# EAGLE schematic HV Board rev14 (EAGLE 9.6.2)
ENGINEER: Arvind Srinivasan

## Sheet 1 of 3: GLV Systems 1 (Main I/O, Power, Current Sensors, and Shutdown Circuit)
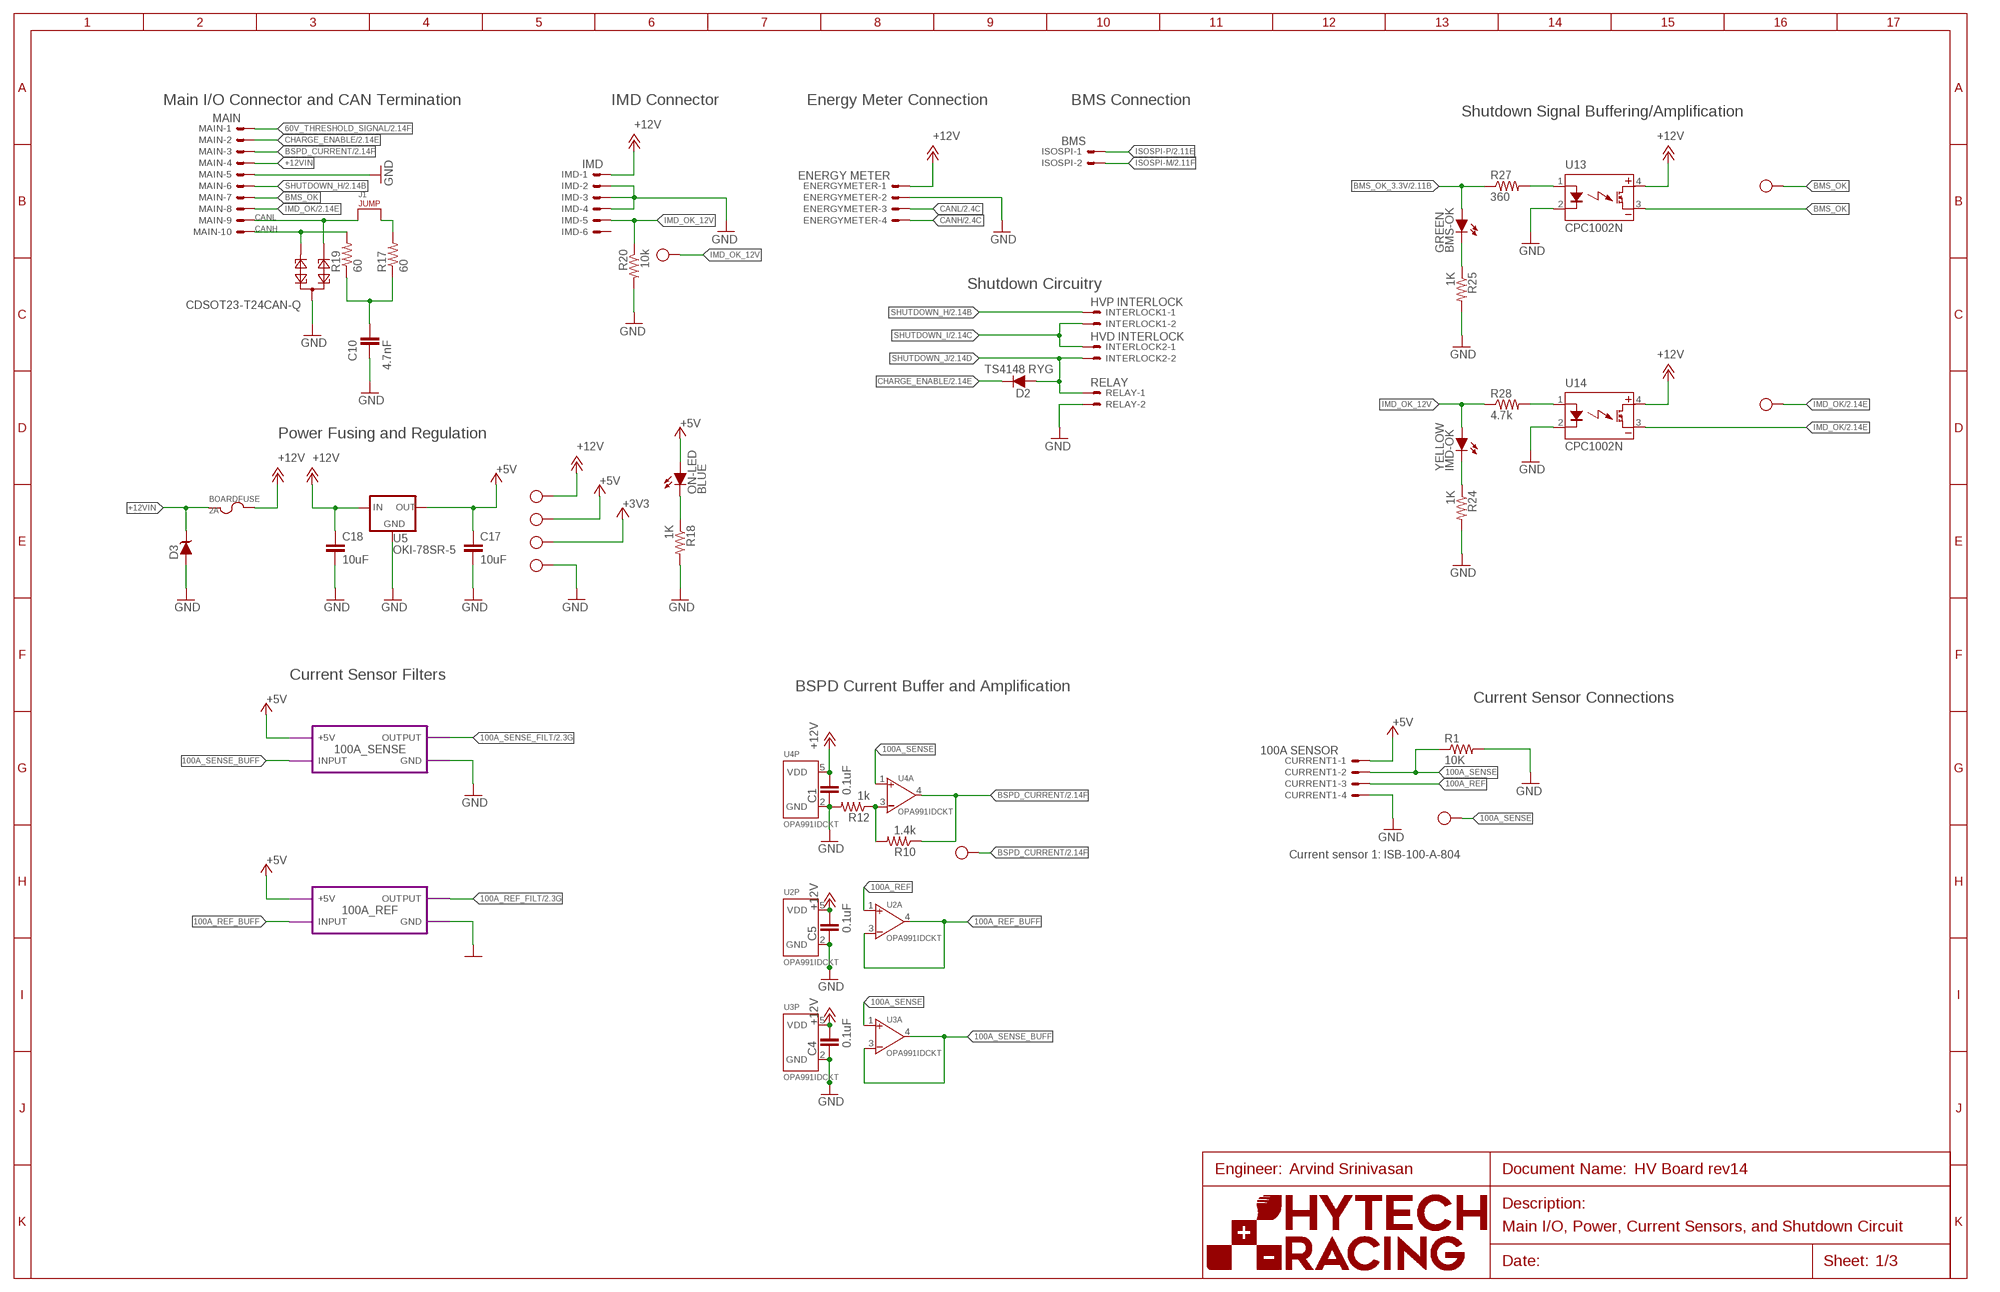
[diagram p0: schematic, sheet 1]
U$1 (FRAME_B): FRAME_DESCRIPTION: Main I/O, Power, Current Sensors, and Shutdown Circuit; ORIENTATION: LANDSCAPE; SIZE: B

### Parts
$$U$3  TEST_POINTMICRO_MINIATURE  [MICRO_MINIATURE]
$$U$12  TEST_POINTMICRO_MINIATURE  [MICRO_MINIATURE]
BMS-OK  GREEN  LED-0603  [LED-603]
BOARDFUSE  2A  FUSE_MINIBLADE  [MINI-BLADE_FUSE_HOLDER]
C1  0.1uF  CAP0603-CAP  [0603-CAP@1]
C4  0.1uF  CAP0603-CAP  [0603-CAP@1]
C5  0.1uF  CAP0603-CAP  [0603-CAP@1]
C10  4.7nF  CAP0603-CAP  [0603-CAP@1]
C17  10uF  CAP0603-CAP  [0603-CAP@1]
C18  10uF  CAP0603-CAP  [0603-CAP@1]
CURRENT1  100A SENSOR  CONNECTOR-4NANO-FIT-VERTICAL-4  [NANO-FIT_VERTICAL-4]
D2  TS4148 RYG  DIODE0805  [0805_D]
D3  TVS_15V  [SOT-23]
ENERGYMETER  ENERGY METER  CONNECTOR-4NANO-FIT-VERTICAL-4  [NANO-FIT_VERTICAL-4]
IMD  IMD  CONNECTOR-6NANO-FIT_VERTICAL-6  [NANO-FIT_VERTICAL-6]
IMD-OK  YELLOW  LED-0603  [LED-603]
INTERLOCK1  HVP INTERLOCK  CONNECTOR-2NANO-FIT_VERTICAL-2  [NANO-FIT_VERTICAL-2]
INTERLOCK2  HVD INTERLOCK  CONNECTOR-2NANO-FIT_VERTICAL-2  [NANO-FIT_VERTICAL-2]
ISOSPI  BMS  CONNECTOR-2NANO-FIT_VERTICAL-2  [NANO-FIT_VERTICAL-2]
J1  JUMPER.1  [1X02]
MAIN  MAIN  CONNECTOR-10NANO-FIT_VERTICAL-10  [NANO-FIT_VERTICAL-10]
ON-LED  BLUE  LED-0603  [LED-603]
R1  10K  RESISTOR0603  [0603-RES@1]
R10  1.4k  RESISTOR0603  [0603-RES@1]
R12  1k  RESISTOR0603  [0603-RES@1]
R17  60  RESISTOR0603  [0603-RES@1]
R18  1K  RESISTOR0603  [0603-RES@1]
R19  60  RESISTOR0603  [0603-RES@1]
R20  10k  RESISTOR0603  [0603-RES@1]
R24  1K  RESISTOR0603  [0603-RES@1]
R25  1K  RESISTOR0603  [0603-RES@1]
R27  360  RESISTOR0603  [0603-RES@1]
R28  4.7k  RESISTOR0603  [0603-RES@1]
RELAY  RELAY  CONNECTOR-2NANO-FIT_VERTICAL-2  [NANO-FIT_VERTICAL-2]
U2  OPAMP_1_CHANNEL_OPA991  [SC-70-5]
U3  OPAMP_1_CHANNEL_OPA991  [SC-70-5]
U4  OPAMP_1_CHANNEL_OPA991  [SC-70-5]
U5  OKI-78SR-5  [OKI-78SR@1]
U10  CDSOT23-T24CAN-Q  [SOT23]
U13  CPC1002N  [SOP04]
U14  CPC1002N  [SOP04]
U$3  TEST_POINTMICRO_MINIATURE  [MICRO_MINIATURE]
U$4  TEST_POINTMICRO_MINIATURE  [MICRO_MINIATURE]
U$5  TEST_POINTMICRO_MINIATURE  [MICRO_MINIATURE]
U$6  TEST_POINTMICRO_MINIATURE  [MICRO_MINIATURE]
U$7  TEST_POINTMICRO_MINIATURE  [MICRO_MINIATURE]
U$11  TEST_POINTMICRO_MINIATURE  [MICRO_MINIATURE]
U$13  TEST_POINTMICRO_MINIATURE  [MICRO_MINIATURE]

### Module instances
100A_SENSE = 1KHZ-FILTER
100A_REF = 1KHZ-FILTER

### Nets
60V_THRESHOLD_SIGNAL: MAIN.P$1 ; also sheet 2,3
100A_REF: CURRENT1.P$3 U2.1(A:VIN+)
100A_REF_BUFF: U2.3(A:VIN-) U2.4(A:VOUT) ; port 100A_REF.INPUT
100A_REF_FILT: port 100A_REF.OUTPUT ; also sheet 2
100A_SENSE: CURRENT1.P$2 R1.1 U3.1(A:VIN+) U4.1(A:VIN+) U$4.P$1
100A_SENSE_BUFF: U3.3(A:VIN-) U3.4(A:VOUT) ; port 100A_SENSE.INPUT
100A_SENSE_FILT: port 100A_SENSE.OUTPUT ; also sheet 2
+3V3: U$7.P$1 ; also sheet 2
+5V: $$U$3.P$1 C17.1 CURRENT1.P$1 ON-LED.A U5.3(OUT) ; port 100A_SENSE.+5V 100A_REF.+5V ; also sheet 2
+12V: BOARDFUSE.R1 BOARDFUSE.R2 C1.2 C4.2 C5.2 C18.1 ENERGYMETER.P$1 IMD.P$1 U2.5(P:VDD) U3.5(P:VDD) U4.5(P:VDD) U5.1(IN) U13.4(DC+) U14.4(DC+) U$5.P$1 ; also sheet 2,3
+12VIN: BOARDFUSE.L1 BOARDFUSE.L2 D3.3(C) MAIN.P$4
BMS_OK: MAIN.P$7 U13.3(DC-) U$13.P$1
BMS_OK_3.3V: BMS-OK.A R27.1 ; also sheet 2
BSPD_CURRENT: MAIN.P$3 R10.1 U4.4(A:VOUT) U$6.P$1 ; also sheet 2
CANH: ENERGYMETER.P$4 MAIN.P$10 R19.2 U10.2 ; also sheet 2
CANL: ENERGYMETER.P$3 J1.1 MAIN.P$9 U10.1 ; also sheet 2
CHARGE_ENABLE: D2.C MAIN.P$2 ; also sheet 2
GND: C1.1 C4.1 C5.1 C10.1 C17.2 C18.2 CURRENT1.P$4 D3.1(A) ENERGYMETER.P$2 IMD.P$2 IMD.P$3 IMD.P$4 MAIN.P$5 R1.2 R12.2 R18.2 R20.2 R24.2 R25.2 RELAY.P$2 U2.2(P:GND) U3.2(P:GND) U4.2(P:GND) U5.2(GND) U10.3 U13.2(CONTROL-) U14.2(CONTROL-) U$3.P$1 ; port 100A_SENSE.GND 100A_REF.GND ; also sheet 2,3
IMD_OK: $$U$12.P$1 MAIN.P$8 U14.3(DC-) ; also sheet 2
IMD_OK_12V: IMD-OK.A IMD.P$5 R20.1 R28.1 U$11.P$1
ISOSPI-M [ISO_SPI]: ISOSPI.P$2 ; also sheet 2
ISOSPI-P [ISO_SPI]: ISOSPI.P$1 ; also sheet 2
N$3: ON-LED.C R18.1
N$8: R28.2 U14.1(CONTROL+)
N$9: IMD-OK.C R24.1
N$11: C10.2 R17.1 R19.1
N$15: R10.2 R12.1 U4.3(A:VIN-)
N$16: R27.2 U13.1(CONTROL+)
N$17: BMS-OK.C R25.1
N$23: J1.2 R17.2
SHUTDOWN_H: INTERLOCK1.P$1 MAIN.P$6 ; also sheet 2
SHUTDOWN_I: INTERLOCK1.P$2 INTERLOCK2.P$1 ; also sheet 2
SHUTDOWN_J: D2.A INTERLOCK2.P$2 RELAY.P$1 ; also sheet 2,3
Unconnected: IMD.P$6

### Notes on the sheet
- Main I/O Connector and CAN Termination | IMD Connector | Energy Meter Connection | BMS Connection
- Shutdown Signal Buffering/Amplification
- Shutdown Circuitry
- Power Fusing and Regulation
- Current Sensor Filters
- BSPD Current Buffer and Amplification
- Current Sensor Connections
- Current sensor 1: ISB-100-A-804

## Sheet 2 of 3: GLV Systems 2 (Microcontroller, Watchdog, BMS, CAN, and ADC)
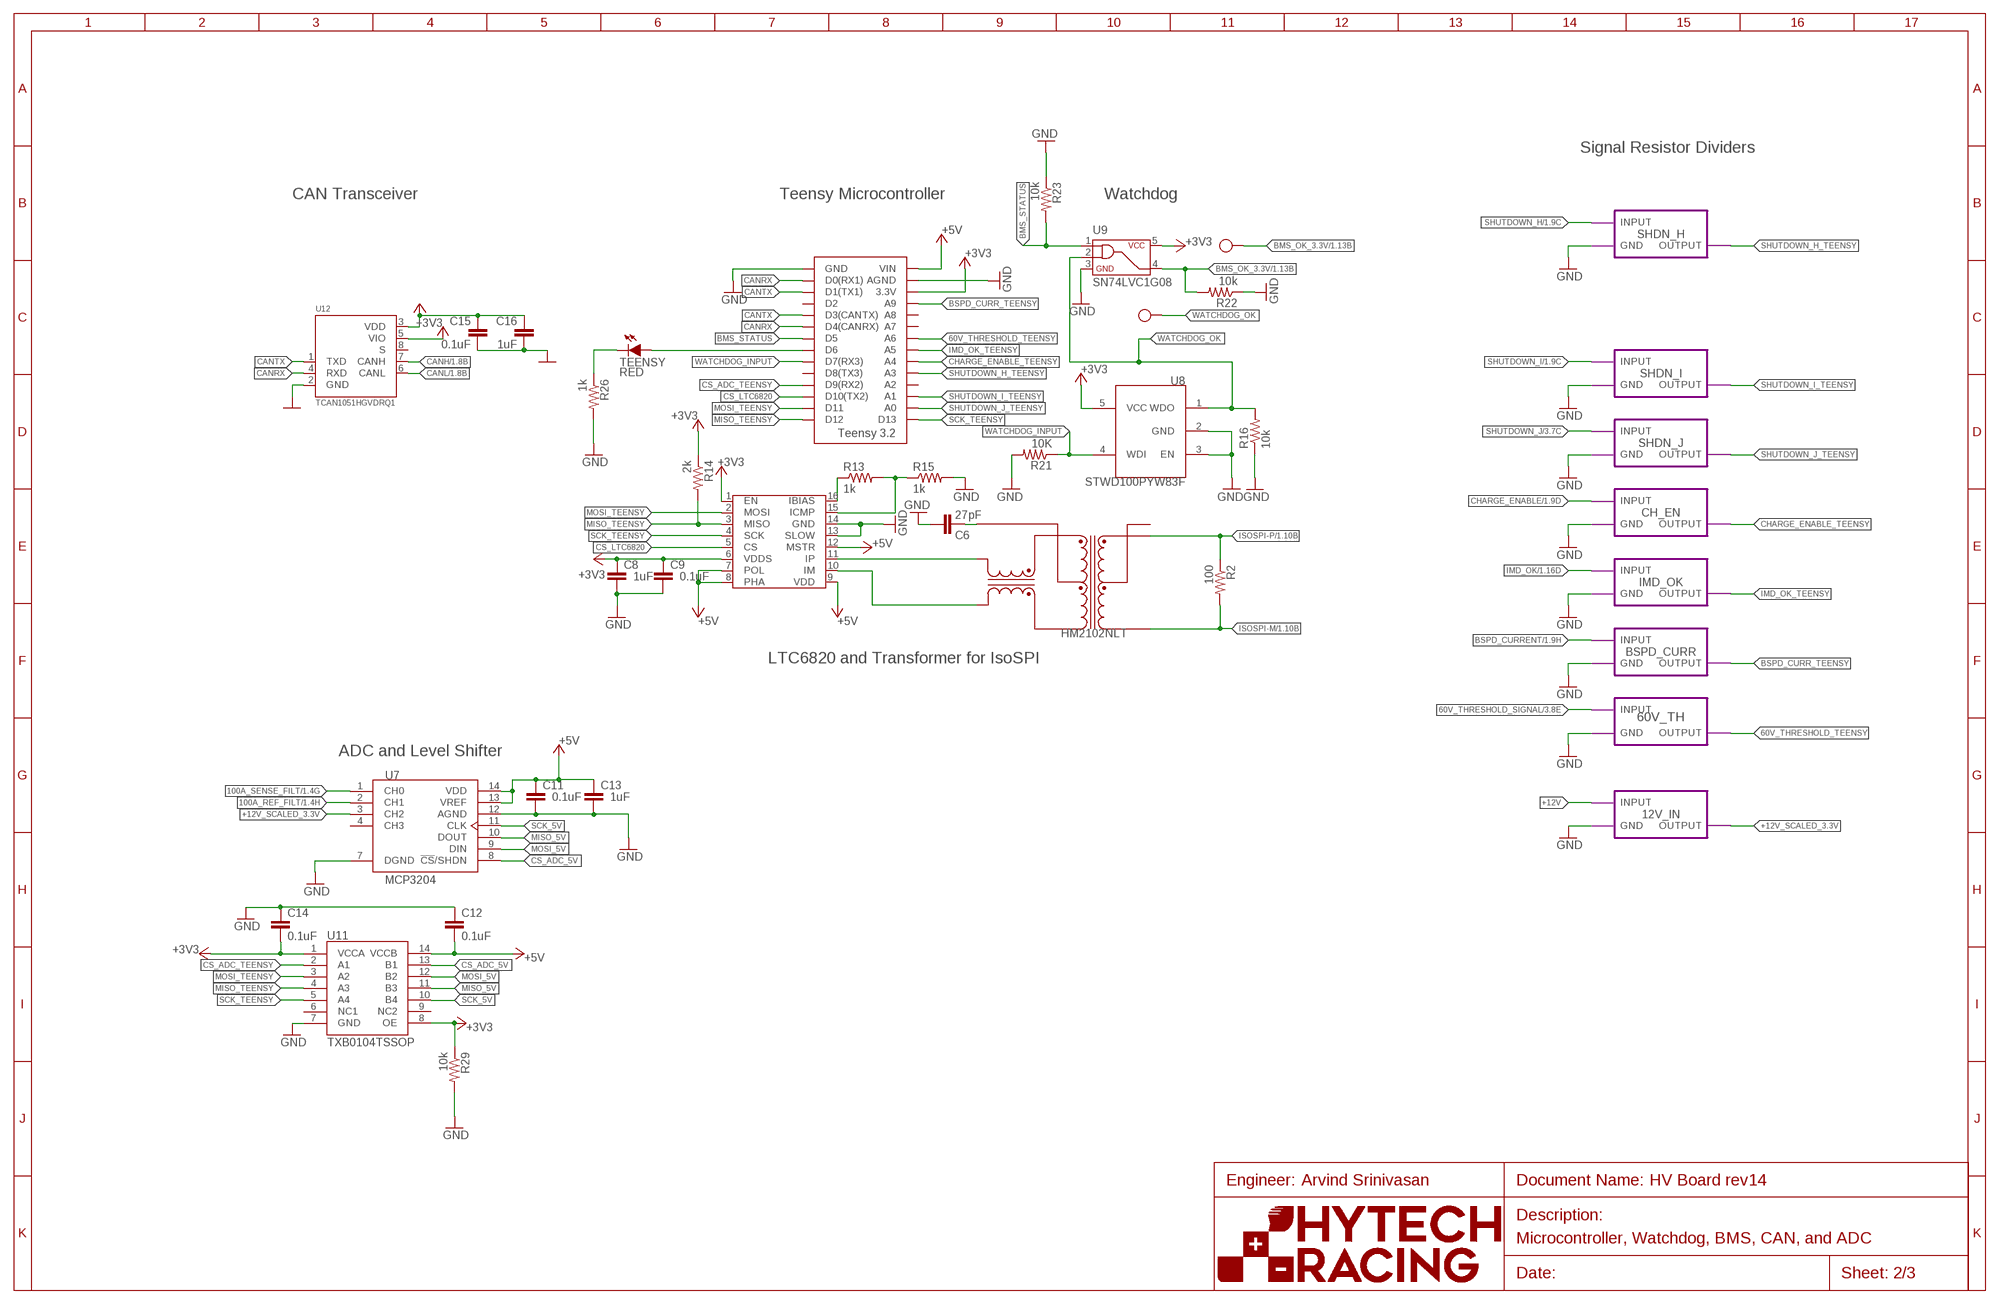
[diagram p1: schematic, sheet 2]
U$12 (FRAME_B): FRAME_DESCRIPTION: Microcontroller, Watchdog, BMS, CAN, and ADC; ORIENTATION: LANDSCAPE; SIZE: B

### Parts
C6  27pF  CAP0603-CAP  [0603-CAP@1]
C8  1uF  CAP0603-CAP  [0603-CAP@1]
C9  0.1uF  CAP0603-CAP  [0603-CAP@1]
C11  0.1uF  CAP0603-CAP  [0603-CAP@1]
C12  0.1uF  CAP0603-CAP  [0603-CAP@1]
C13  1uF  CAP0603-CAP  [0603-CAP@1]
C14  0.1uF  CAP0603-CAP  [0603-CAP@1]
C15  0.1uF  CAP0603-CAP  [0603-CAP@1]
C16  1uF  CAP0603-CAP  [0603-CAP@1]
R2  100  RESISTOR0603  [0603-RES@1]
R13  1k  RESISTOR0603  [0603-RES@1]
R14  2k  RESISTOR0603  [0603-RES@1]
R15  1k  RESISTOR0603  [0603-RES@1]
R16  10k  RESISTOR0603  [0603-RES@1]
R21  10K  RESISTOR0603  [0603-RES@1]
R22  10k  RESISTOR0603  [0603-RES@1]
R23  10k  RESISTOR0603  [0603-RES@1]
R26  1k  RESISTOR0603  [0603-RES@1]
R29  10k  RESISTOR0603  [0603-RES@1]
TEENSY  RED  LED-0603  [LED-603]
TEENSY3.1  TEENSY_3.2_SIMPLE  [TEENSY_3.2_SIMPLE]
U1  HM2102NLT  [HM2102NLT]
U6  LTC6820  [MSOP-16]
U7  MCP3204  [SO14]
U8  STWD100PYW83F  [SOT323-5]
U9  SN74LVC1G08  SN74LVC1G08SOT-323-5  [SOT323-5]
U11  TXB0104TSSOP  [TSSOP-14]
U12  CAN_TRANSCIEVER_TCAN1051HQV-Q1  [SOIC-08]
U$9  TEST_POINTMICRO_MINIATURE  [MICRO_MINIATURE]
U$10  TEST_POINTMICRO_MINIATURE  [MICRO_MINIATURE]

### Module instances
SHDN_J = 43/12-RESISTOR-DIVIDER
SHDN_H = 43/12-RESISTOR-DIVIDER
IMD_OK = 43/12-RESISTOR-DIVIDER
BSPD_CURR = 43/12-RESISTOR-DIVIDER
CH_EN = 43/12-RESISTOR-DIVIDER
SHDN_I = 43/12-RESISTOR-DIVIDER
12V_IN = 43/12-RESISTOR-DIVIDER
60V_TH = 43/12-RESISTOR-DIVIDER

### Nets
60V_THRESHOLD_SIGNAL: port 60V_TH.INPUT ; also sheet 1,3
60V_THRESHOLD_TEENSY: TEENSY3.1.A6 ; port 60V_TH.OUTPUT
100A_REF_FILT: U7.2(CH1) ; also sheet 1
100A_SENSE_FILT: U7.1(CH0) ; also sheet 1
+3V3: C8.1 C9.1 C14.1 R14.1 R29.1 TEENSY3.1.3.3V U6.1(EN) U6.6(VDDS) U8.5(VCC) U9.5 U11.1(VCCA) U11.8(OE) U12.5(VIO) ; also sheet 1
+5V: C11.1 C12.1 C13.1 C15.2 C16.2 TEENSY3.1.VIN U6.7(POL) U6.8(PHA) U6.9(VDD) U6.12(MSTR) U7.13(VREF) U7.14(VDD) U11.14(VCCB) U12.3(VDD) ; also sheet 1
+12V: port 12V_IN.INPUT ; also sheet 1,3
+12V_SCALED_3.3V: U7.3(CH2) ; port 12V_IN.OUTPUT
BMS_OK_3.3V: R22.2 U9.4 U$10.P$1 ; also sheet 1
BMS_STATUS: R23.2 TEENSY3.1.D5 U9.1
BSPD_CURR_TEENSY: TEENSY3.1.A9 ; port BSPD_CURR.OUTPUT
BSPD_CURRENT: port BSPD_CURR.INPUT ; also sheet 1
CANH: U12.7(CANH) ; also sheet 1
CANL: U12.6(CANL) ; also sheet 1
CANRX: TEENSY3.1.D0(RX1) TEENSY3.1.D4(CANRX) U12.4(RXD)
CANTX: TEENSY3.1.D1(TX1) TEENSY3.1.D3(CANTX) U12.1(TXD)
CHARGE_ENABLE: port CH_EN.INPUT ; also sheet 1
CHARGE_ENABLE_TEENSY: TEENSY3.1.A4 ; port CH_EN.OUTPUT
CS_ADC_5V: U7.8(!CS!/SHDN) U11.13(B1)
CS_ADC_TEENSY: TEENSY3.1.D9(RX2) U11.2(A1)
CS_LTC6820: TEENSY3.1.D10(TX2) U6.5(CS)
GND: C6.2 C8.2 C9.2 C11.2 C12.2 C13.2 C14.2 C15.1 C16.1 R15.2 R16.1 R21.2 R22.1 R23.1 R26.2 R29.2 TEENSY3.1.AGND TEENSY3.1.GND U6.13(SLOW) U6.14(GND) U7.7(DGND) U7.12(AGND) U8.2(GND) U8.3(EN) U9.3 U11.7(GND) U12.2(GND) ; port SHDN_H.GND SHDN_J.GND CH_EN.GND IMD_OK.GND BSPD_CURR.GND 60V_TH.GND SHDN_I.GND 12V_IN.GND ; also sheet 1,3
IM: U1.P$10(TD-) U6.10(IM)
IMD_OK: port IMD_OK.INPUT ; also sheet 1
IMD_OK_TEENSY: TEENSY3.1.A5 ; port IMD_OK.OUTPUT
IP: U1.P$12(TD+) U6.11(IP)
ISOSPI-M [ISO_SPI]: R2.2 U1.P$3(MX-) ; also sheet 1
ISOSPI-P [ISO_SPI]: R2.1 U1.P$1(MX+) ; also sheet 1
MISO_5V: U7.10(DOUT) U11.11(B3)
MISO_TEENSY: R14.2 TEENSY3.1.D12 U6.3(MISO) U11.4(A3)
MOSI_5V: U7.9(DIN) U11.12(B2)
MOSI_TEENSY: TEENSY3.1.D11 U6.2(MOSI) U11.3(A2)
N$29: R26.1 TEENSY.C
N$31: R13.1 U6.16(IBIAS)
N$32: R13.2 R15.1 U6.15(ICMP)
N$35: C6.1 U1.P$11(TCT)
SCK_5V: U7.11(CLK) U11.10(B4)
SCK_TEENSY: TEENSY3.1.D13 U6.4(SCK) U11.5(A4)
SHUTDOWN_H: port SHDN_H.INPUT ; also sheet 1
SHUTDOWN_H_TEENSY: TEENSY3.1.A3 ; port SHDN_H.OUTPUT
SHUTDOWN_I: port SHDN_I.INPUT ; also sheet 1
SHUTDOWN_I_TEENSY: TEENSY3.1.A1 ; port SHDN_I.OUTPUT
SHUTDOWN_J: port SHDN_J.INPUT ; also sheet 1,3
SHUTDOWN_J_TEENSY: TEENSY3.1.A0 ; port SHDN_J.OUTPUT
TEENSY_STATUS: TEENSY3.1.D6 TEENSY.A
WATCHDOG_INPUT: R21.1 TEENSY3.1.D7(RX3) U8.4(WDI)
WATCHDOG_OK: R16.2 U8.1(WDO) U9.2 U$9.P$1
Unconnected: TEENSY3.1.A2 TEENSY3.1.A7 TEENSY3.1.A8 TEENSY3.1.D2 TEENSY3.1.D8(TX3) U1.P$2(MCT) U1.P$4(MX+) U1.P$5(MCT) U1.P$6(MX-) U1.P$7(TD-) U1.P$8(TCT) U1.P$9(TD+) U7.4(CH3) U11.6(NC1) U11.9(NC2) U12.8(S)

### Notes on the sheet
- Signal Resistor Dividers
- CAN Transceiver | Teensy Microcontroller | Watchdog
- LTC6820 and Transformer for IsoSPI
- ADC and Level Shifter

## Sheet 3 of 3: HV Systems (Discharge, Precharge, and TSAL Signal/Voltage Indicator)
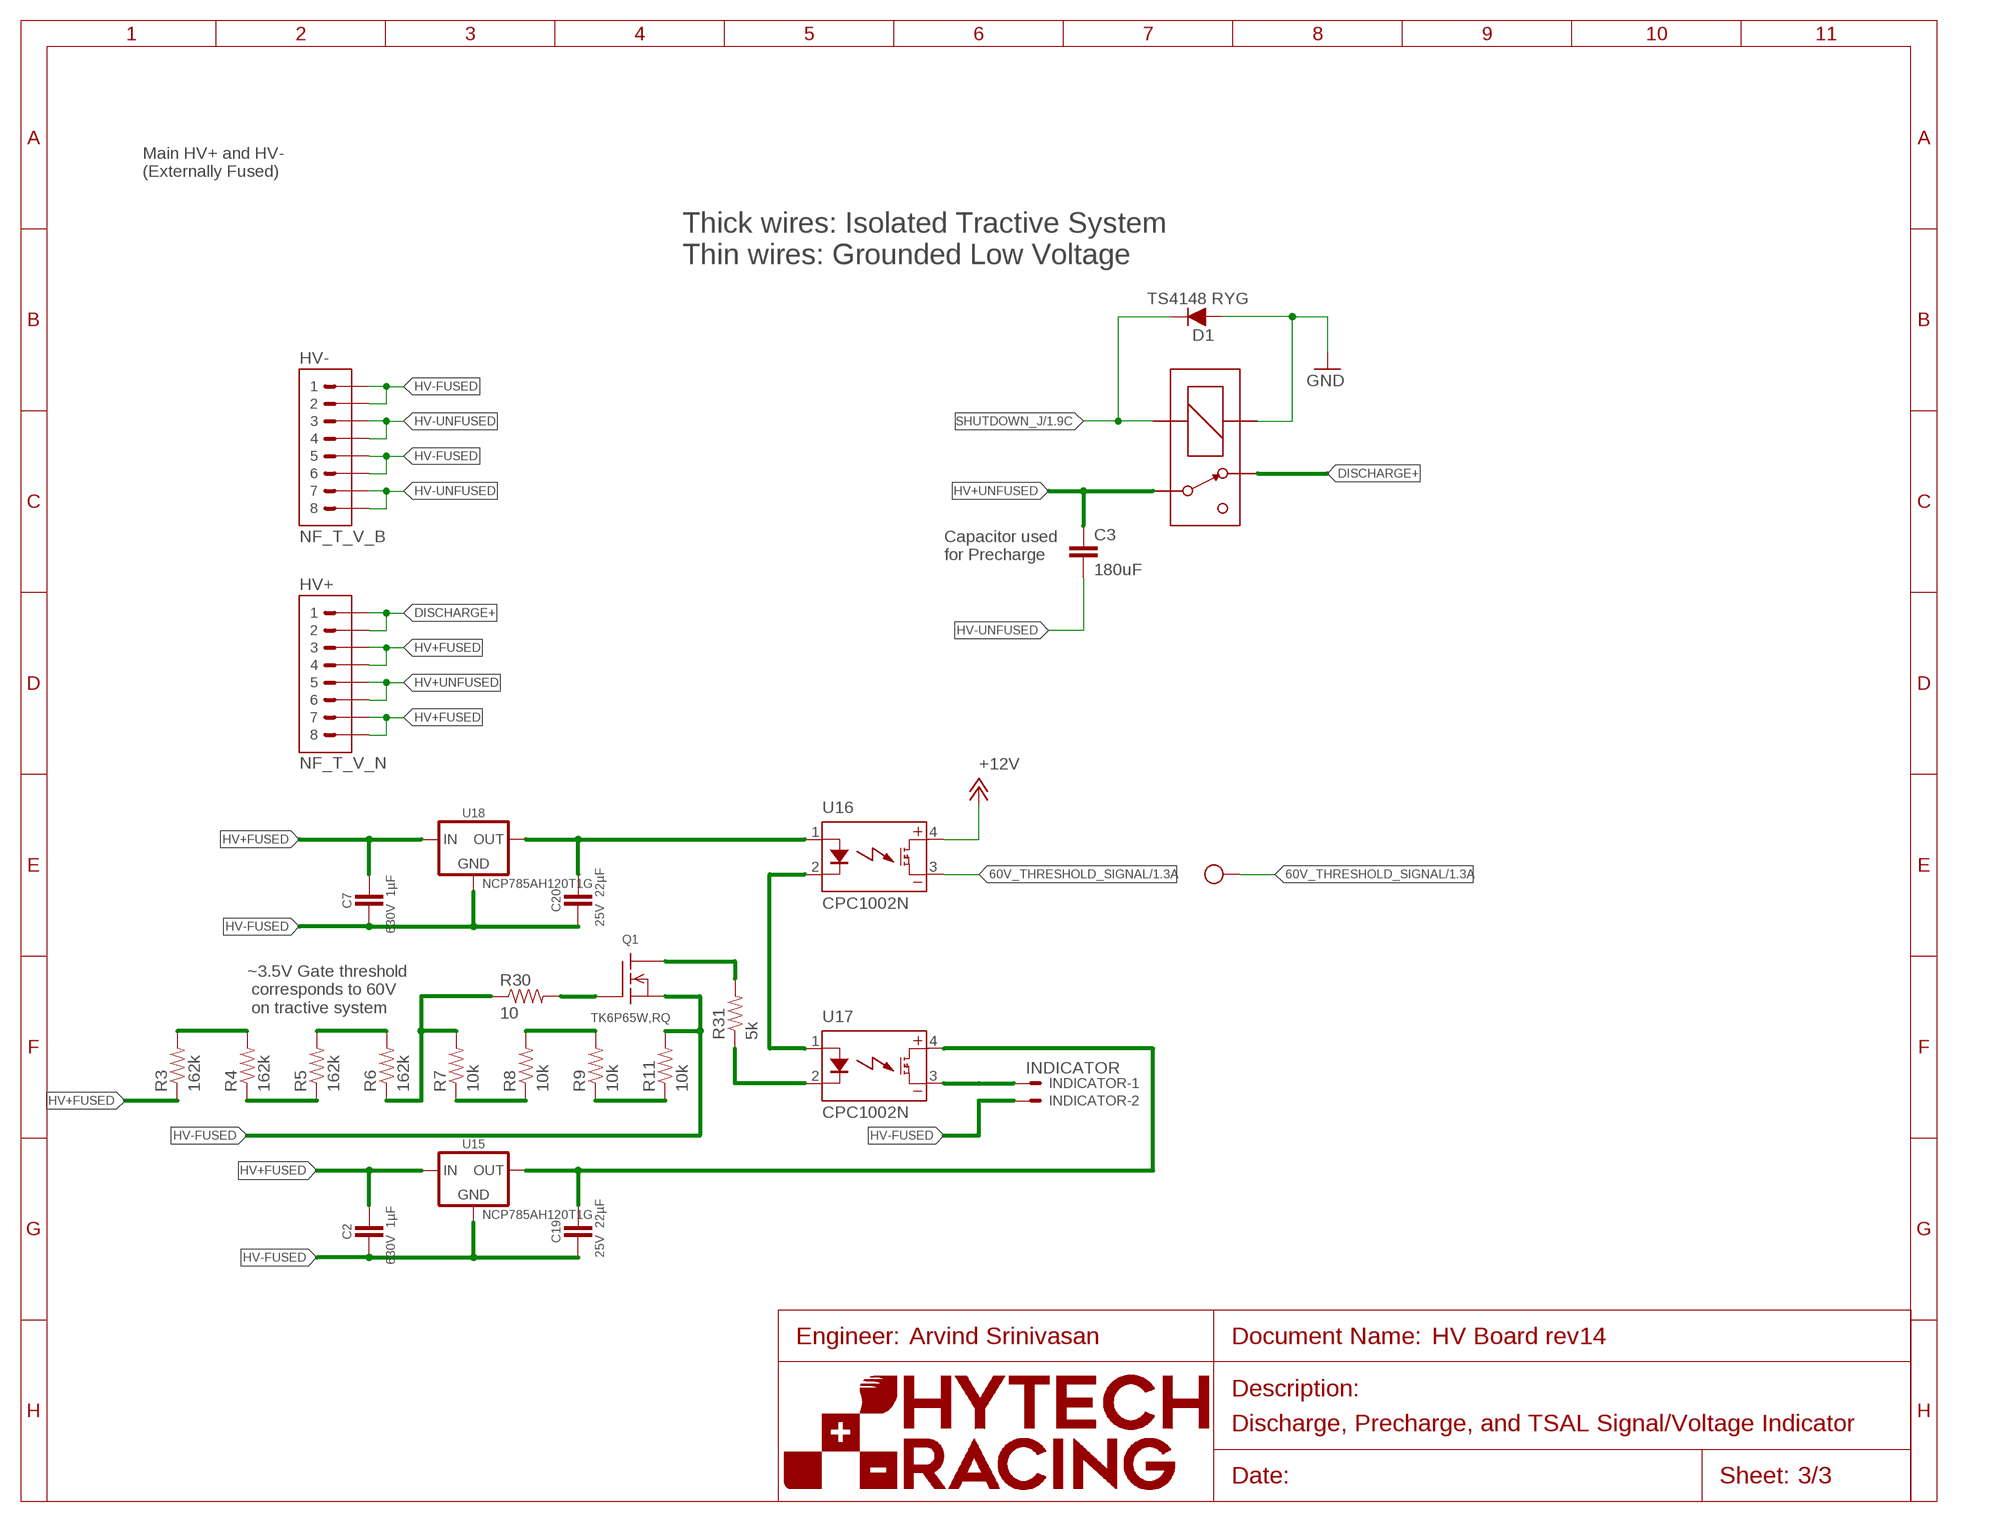
[diagram p2: schematic, sheet 3]
U$2 (FRAME_A): FRAME_DESCRIPTION: Discharge, Precharge, and TSAL Signal/Voltage Indicator; ORIENTATION: LANDSCAPE; SIZE: A

### Parts
$$$$U$3  DBT71210  [DBT71210]
C2  CAPACITOR_2220_630V_1UF  [2220-CAP]
C3  180uF  CAP  [LLS2V181MELA]
C7  CAPACITOR_2220_630V_1UF  [2220-CAP]
C19  CAPACITOR_0805_25V_22UF  [0805-CAP]
C20  CAPACITOR_0805_25V_22UF  [0805-CAP]
D1  TS4148 RYG  DIODE0805  [0805_D]
HV+  CONNECTOR-8_NF_T_V_NATURAL  [MOLEX_NANOFIT_PTH_08]
HV-  CONNECTOR-8_NF_T_V_BLACK  [MOLEX_NANOFIT_PTH_08]
INDICATOR  INDICATOR  CONNECTOR-2NANO-FIT_VERTICAL-2  [NANO-FIT_VERTICAL-2]
Q1  TRANSISTOR_N_MOS_2-7K1S_TK6P65W  [DPAK(2-7K1S)]
R3  162k  RESISTOR0603  [0603-RES@1]
R4  162k  RESISTOR0603  [0603-RES@1]
R5  162k  RESISTOR0603  [0603-RES@1]
R6  162k  RESISTOR0603  [0603-RES@1]
R7  10k  RESISTOR0603  [0603-RES@1]
R8  10k  RESISTOR0603  [0603-RES@1]
R9  10k  RESISTOR0603  [0603-RES@1]
R11  10k  RESISTOR0603  [0603-RES@1]
R30  10  RESISTOR0603  [0603-RES@1]
R31  5k  RESISTOR0603  [0603-RES@1]
U15  VOLTAGE_REGULATOR_SOT89_12V  [SOT89]
U16  CPC1002N  [SOP04]
U17  CPC1002N  [SOP04]
U18  VOLTAGE_REGULATOR_SOT89_12V  [SOT89]
U$8  TEST_POINTMICRO_MINIATURE  [MICRO_MINIATURE]

### Nets
60V_THRESHOLD_SIGNAL: U16.3(DC-) U$8.P$1 ; also sheet 1,2
+12V: U16.4(DC+) ; also sheet 1,2
DISCHARGE+ [TS]: $$$$U$3.CONTACT2(O) HV+.1 HV+.2
GND: $$$$U$3.COIL+ D1.A ; also sheet 1,2
HV+FUSED [TS]: C2.1 C7.1 HV+.3 HV+.4 HV+.7 HV+.8 R3.1 U15.1(IN) U18.1(IN)
HV+UNFUSED [TS]: $$$$U$3.CONTACT1(P) C3.P$1 HV+.5 HV+.6
HV-FUSED [TS]: C2.2 C7.2 C19.2 C20.2 HV-.1 HV-.2 HV-.5 HV-.6 INDICATOR.P$2 Q1.3(S) R11.2 U15.2(GND) U15.2@2(GND) U18.2(GND) U18.2@2(GND)
HV-UNFUSED: C3.P$2 HV-.3 HV-.4 HV-.7 HV-.8
N$4: Q1.1(G) R30.2
N$5 [TS]: C19.1 U15.3(OUT) U17.4(DC+)
N$7 [TS]: R9.1 R11.1
N$10 [TS]: R8.2 R9.2
N$12 [TS]: R7.1 R8.1
N$18 [TS]: C20.1 U16.1(CONTROL+) U18.3(OUT)
N$19 [TS]: R6.1 R7.2 R30.1
N$20 [TS]: R5.2 R6.2
N$21 [TS]: R4.1 R5.1
N$22 [TS]: R3.2 R4.2
N$30 [TS]: R31.1 U17.2(CONTROL-)
N$33 [TS]: U16.2(CONTROL-) U17.1(CONTROL+)
N$34 [TS]: INDICATOR.P$1 U17.3(DC-)
N$58 [TS]: Q1.2(D) R31.2
SHUTDOWN_J: $$$$U$3.COIL- D1.C ; also sheet 1,2

### Notes on the sheet
- Main HV+ and HV-
  (Externally Fused)
- Thick wires: Isolated Tractive System
  Thin wires: Grounded Low Voltage
- Capacitor used
  for Precharge
- ~3.5V Gate threshold
   corresponds to 60V
   on tractive system

## Library data of the parts
$$$$U$3 = HyTechDevices:DBT71210: DBT71210 Reed Relay Form B (Standard normally closed), switch 12V
$$U$3 $$U$12 U$3-U$11 U$13 = HyTechDevices:TEST_POINT: Keystone Electronics Test Point 5005
BMS-OK IMD-OK ON-LED TEENSY = HyTechDevices:LED: Light Emitting Diode (LED) Source: Dangerous Prototypes Eagle Library <https://github.com/DangerousPrototypes/Eagle_Part_Library>
BOARDFUSE = HyTechDevices:FUSE: Fuse/Fuseclips Keystone Electronics 3568 Fuse Mouser Part <http://www.mouser.com/ProductDetail/Keystone-Electronics/3568> Datasheet <http://www.mouser.com/ds/2/215/568-742601.pdf> Bussman/Eaton Midget Fuse Clip 1A3400 <http://www.mouser.com/ProductDetail/Bussmann-Eaton/BK-1A3400-09-R/?qs=sGAEpiMZZMuG%252bgnN5hGYGzzlAelq2OxnKqVSMVjq8I4%3d> Schurter 0751.0110 Brass Fuse Clip Datasheet <http://www.mouser.com/ds/2/358/typ_OG__Clip__5x20-2553.pdf> Bel Fuse 0ZCF Series Surface Mount PTC (resettable) Fuse Datasheet <https://belfuse.com/resources/CircuitProtection/datasheets/0ZCF%20Nov2016.pdf> Littelfuse 1812L Series Surface Mount PTC (resettable) Fuse Datasheet <https://m.littelfuse.com/~/media/electronics/datasheets/resettable_ptcs/littelfuse_ptc_1812l_datasheet.pdf.pdf>; RATING: 3A
C1 C4 C5 C10 = HyTechDevices:CAP: Capacitor Standard 0603 ceramic capacitor, and 0.1" leaded capacitor.; TOLERANCE: 5%; VOLTAGE: 50V
C2 C7 = HyTechDevices:CAPACITOR_?_*: Capacitor, Non-Polarized VJ...1BC Series Datasheet <https://www.mouser.com/datasheet/2/427/vjw1bcbascomseries-1762447.pdf> Samsung Datasheet <https://www.mouser.com/datasheet/2/585/MLCC-1837944.pdf> Walsin Datasheet <https://www.mouser.com/datasheet/2/210/WTC_MLCC_General_Purpose-1534899.pdf> GRM188R61A226ME15D <https://www.mouser.com/datasheet/2/281/1/GRM188R61A226ME15_02A-1985787.pdf> GRM188R61E106MA73D <https://www.mouser.com/datasheet/2/281/1/GRM188R61E106MA73_01A-1985806.pdf> 885012006013 <https://www.mouser.com/datasheet/2/445/885012006013-1726946.pdf> 2220Y6300105KXTWS2 <https://www.mouser.com/datasheet/2/218/SMD_High_and_Std_StackiCap_P62-1825512.pdf> Yageo Class 2, X5R <https://www.mouser.com/datasheet/2/447/UPY_GPHC_X5R_4V_to_50V_26-1827097.pdf>; CAPACITANCE: 1µF; DKPN: 1608-2220Y6300105KXTWS2CT-ND; MANUFACTURER: Knowles Syfer; MOPN: 843-2220Y63105KXTWS2; MPN: 2220Y6300105KXTWS2; TOLERANCE: 10%; VOLTAGE: 630V
C3 = HyTechDevices:CAP: Capacitor Standard 0603 ceramic capacitor, and 0.1" leaded capacitor.
C6 C8 C9 C11-C16 = HyTechDevices:CAP: Capacitor Standard 0603 ceramic capacitor, and 0.1" leaded capacitor.; TOLERANCE: 5%; VOLTAGE: 10V
C17 C18 = HyTechDevices:CAP: Capacitor Standard 0603 ceramic capacitor, and 0.1" leaded capacitor.; TOLERANCE: 5%; VOLTAGE: 25V
C19 C20 = HyTechDevices:CAPACITOR_?_*: Capacitor, Non-Polarized VJ...1BC Series Datasheet <https://www.mouser.com/datasheet/2/427/vjw1bcbascomseries-1762447.pdf> Samsung Datasheet <https://www.mouser.com/datasheet/2/585/MLCC-1837944.pdf> Walsin Datasheet <https://www.mouser.com/datasheet/2/210/WTC_MLCC_General_Purpose-1534899.pdf> GRM188R61A226ME15D <https://www.mouser.com/datasheet/2/281/1/GRM188R61A226ME15_02A-1985787.pdf> GRM188R61E106MA73D <https://www.mouser.com/datasheet/2/281/1/GRM188R61E106MA73_01A-1985806.pdf> 885012006013 <https://www.mouser.com/datasheet/2/445/885012006013-1726946.pdf> 2220Y6300105KXTWS2 <https://www.mouser.com/datasheet/2/218/SMD_High_and_Std_StackiCap_P62-1825512.pdf> Yageo Class 2, X5R <https://www.mouser.com/datasheet/2/447/UPY_GPHC_X5R_4V_to_50V_26-1827097.pdf>; CAPACITANCE: 22µF; DKPN: 311-1903-1-ND; MANUFACTURER: Yageo; MOPN: 603-CC805MKX5R8BB226; MPN: CC0805MKX5R8BB226; TOLERANCE: 20%; VOLTAGE: 25V
CURRENT1 ENERGYMETER = HyTechDevices:CONNECTOR-4: Mini-Fit Junior connector 4 pole Source: http://www.molex.com
D1 D2 = HyTechDevices:DIODE: DIODE general purpose rectifier
D3 = HyTechDevices:TVS_*: TVS Diode GSOT Datasheet <https://www.mouser.com/datasheet/2/427/gsot03-1767593.pdf>; DKPN: GSOT15-E3-08CT-ND; MANUFACTURER: Vishay General Semiconductor - Diodes Division; MOPN: 78-GSOT15-E3-08; MPN: GSOT15-E3-08; VOLTAGE: 15V
HV+ = HyTechDevices:CONNECTOR-8_?_*: 8 Pin Connector; MANUFACTURER: Molex; MODEL: NF_T_V_N; MPN: 105310-2308
HV- = HyTechDevices:CONNECTOR-8_?_*: 8 Pin Connector; MANUFACTURER: Molex; MODEL: NF_T_V_B; MPN: 105310-1308
IMD = HyTechDevices:CONNECTOR-6: Mini-Fit Junior connector 6 pole Source: http://www.molex.com
INDICATOR INTERLOCK1 INTERLOCK2 ISOSPI RELAY = HyTechDevices:CONNECTOR-2: Mini-Fit Junior connector 2 pole Source: http://www.molex.com
J1 = HyTechDevices:JUMPER: Jumper for changing operation of a device
MAIN = HyTechDevices:CONNECTOR-10: Mini-Fit Junior connector 10 pole Source: http://www.molex.com
Q1 = HyTechDevices:TRANSISTOR_N_MOS_?_*: N-MOSFET PMV15ENEA Datasheet <https://www.mouser.com/datasheet/2/916/PMV15ENEA-1604828.pdf> TK6P65W Datasheet <https://www.mouser.com/datasheet/2/408/TK6P65W_datasheet_en_20151225-1916290.pdf>; DKPN: TK6P65WRQCT-ND; MANUFACTURER: Toshiba Semiconductor and Storage; MOPN: 757-TK6P65WRQ; MPN: TK6P65W,RQ
R1 R10 R12-R15 R17-R21 R24-R29 = HyTechDevices:RESISTOR: Resistor Basic schematic elements and footprints for 0603, 1206, and PTH resistors.; TOLERANCE: 1%
R2 = HyTechDevices:RESISTOR: Resistor Basic schematic elements and footprints for 0603, 1206, and PTH resistors.; TOLERANCE: 1%; TYPE: TERMINATION
R3-R9 R11 R16 R22 R23 R30 R31 = HyTechDevices:RESISTOR: Resistor Basic schematic elements and footprints for 0603, 1206, and PTH resistors.
TEENSY3.1 = HyTechDevices:TEENSY_3.2_SIMPLE: Simple version of the Teensy 3.2 board that only uses the 2 main rows of pins, not the inner pins or the pins opposite the usb port.
U1 = HyTechDevices:HM2102NLT: 2 Channel SMT Transformer Turns ratio: 1CT: 1CT Isolation Voltage: 4300 VDC Inductance: 150 uH Leakage Inductance: 0.50 uH max DataSheet <https://www.mouser.com/datasheet/2/336/HM2102NL-1218600.pdf>
U2-U4 = HyTechDevices:OPAMP_1_CHANNEL_*: Op-Amp 1 Channel OPA991 Datasheet <https://www.ti.com/lit/ds/symlink/opa991.pdf?ts=1615503614502> Note: OPA991 is also a comparator; MPN: OPA991IDCKT
U5 = HyTechDevices:OKI-78SR-5: Murata OKI-78SR 5V 1.5A Non-Isolated Switching Regulator DC/DC - Datasheet <https://power.murata.com/data/power/oki-78sr.pdf>
U6 = HyTechDevices:LTC6820: Linear Technology isoSPI Isolated Communications Interface Datasheet <http://cds.linear.com/docs/en/datasheet/6820fb.pdf>
U7 = HyTechDevices:MCP3204
U8 = HyTechDevices:STWD100PYW83F: STWD100 Watchdog Timer (push-pull configuration) Datasheet <https://www.st.com/resource/en/datasheet/stwd100.pdf>
U9 = HyTechDevices:SN74LVC1G08: TI SN74LVC1G08 SINGLE 2-INPUT POSITIVE-AND GATE Datasheet <https://www.ti.com/lit/ds/symlink/sn74lvc1g08.pdf>
U10 = HyTechDevices:CDSOT23-T24CAN-Q: CAN Bus dual TVS array for transceiver ESD and surge protection
U11 = HyTechDevices:TXB0104: Texas Instruments TXB0104 4-channel low voltage to high voltage Logic Level Shifter. Minimum input voltage level 1.8V. Maximum output voltage level 5.5V.
U12 = HyTechDevices:CAN_TRANSCIEVER_TCAN1051*V-Q1: TCAN1051*V Can Tranciever Datasheet <https://www.ti.com/lit/ds/symlink/tcan1051hgv-q1.pdf?HQS=dis-mous-null-mousermode-dsf-pf-null-wwe&ts=1610765132518&ref_url=https%253A%252F%252Fwww.mouser.com%252Ff>; DKPN: 296-49935-1-ND; MANUFACTURER: Texas Instruments; MOPN: 595-TCAN1051HGVDQ1; MPN: TCAN1051HGVDRQ1
U13 U14 U16 U17 = HyTechDevices:CPC1002N: IXYS Solid State Relay .7A
U15 U18 = HyTechDevices:VOLTAGE_REGULATOR_?_*: Voltage Regulators LDL1117S50R Datasheet <https://www.mouser.com/datasheet/2/389/dm00366442-1799212.pdf> OKI-78SR Datasheet <https://www.mouser.com/datasheet/2/281/oki-78sr-56393.pdf> NCP785AH120T1G <https://www.mouser.com/datasheet/2/308/NCP785A_D-1812704.pdf>; DKPN: NCP785AH120T1GOSCT-ND; MANUFACTURER: ON Semiconductor; MOPN: 863-NCP785AH120T1G; MPN: NCP785AH120T1G

## Module 43/12-RESISTOR-DIVIDER
Ports: INPUT(in) GND(pwr) OUTPUT(out)
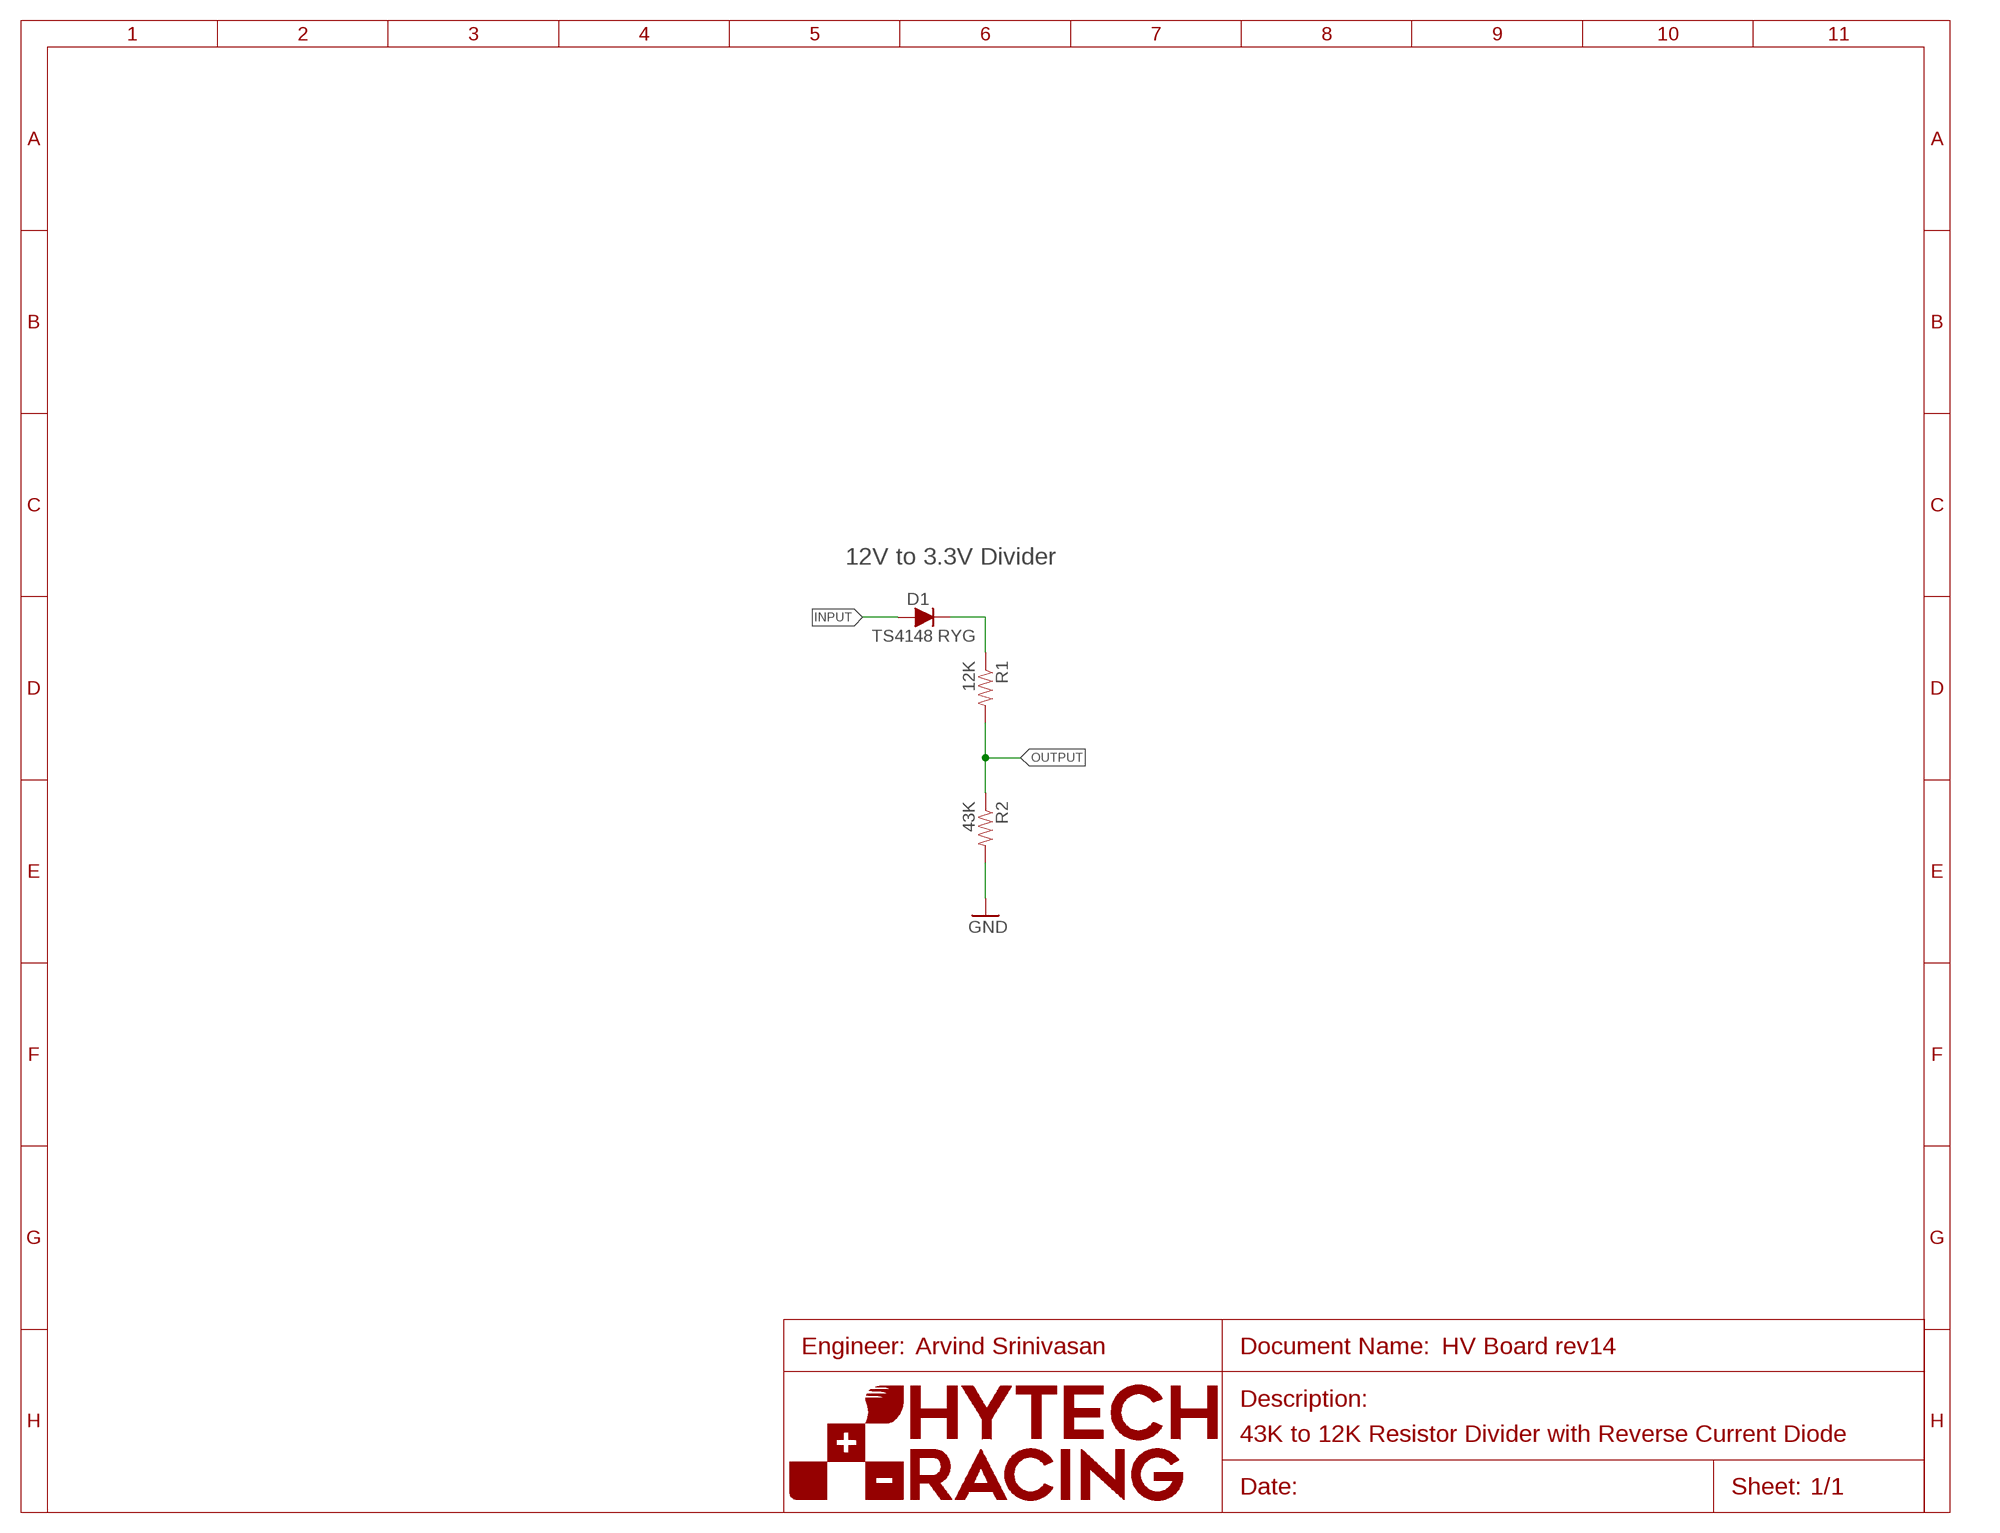
[diagram p3: schematic, module 43/12-RESISTOR-DIVIDER, sheet 1]
U$1 (FRAME_A): FRAME_DESCRIPTION: Default; ORIENTATION: LANDSCAPE; SIZE: A

### Parts
D1  TS4148 RYG  DIODE0805  [0805_D]
R1  12K  RESISTOR0603  [0603-RES@1]
R2  43K  RESISTOR0603  [0603-RES@1]

### Nets
GND: R2.2
INPUT: D1.A
INPUT_POST_DIODE: D1.C R1.1
OUTPUT: R1.2 R2.1

### Notes on the sheet
- 12V to 3.3V Divider
- Arvind Srinivasan
- 43K to 12K Resistor Divider with Reverse Current Diode

### Library data of the parts
D1 = HyTechDevices:DIODE: DIODE general purpose rectifier
R1 R2 = HyTechDevices:RESISTOR: Resistor Basic schematic elements and footprints for 0603, 1206, and PTH resistors.; TOLERANCE: 1%

## Module 10/10-RESISTOR-DIVIDER
Ports: INPUT(in) GND(pwr) OUTPUT(out)
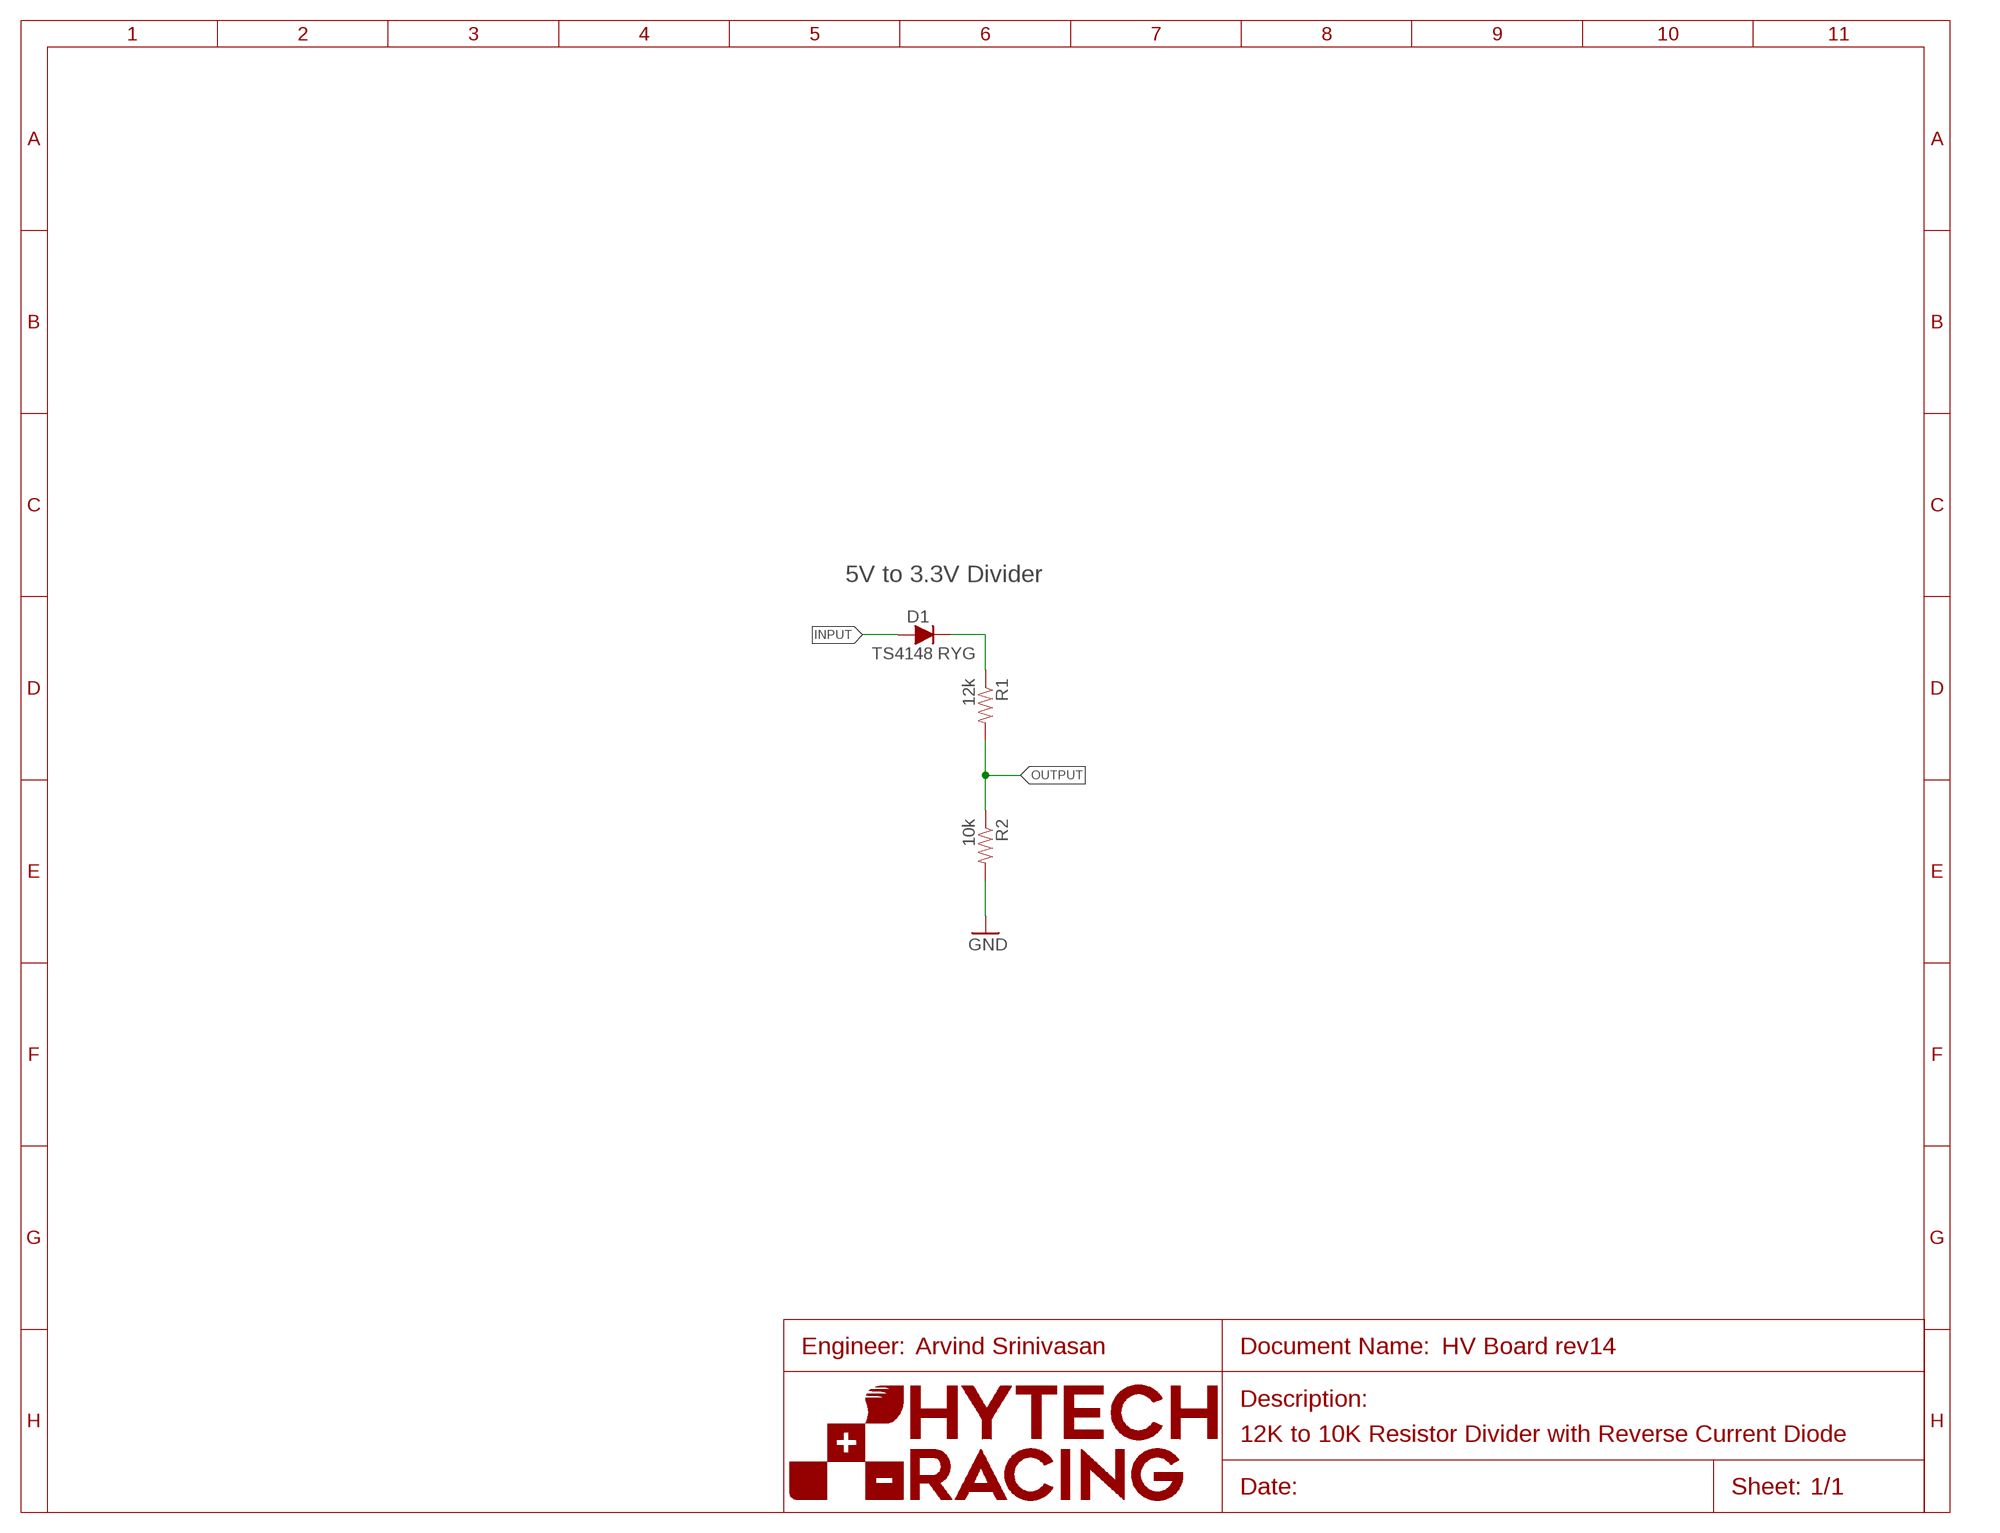
[diagram p4: schematic, module 10/10-RESISTOR-DIVIDER, sheet 1]
U$2 (FRAME_A): FRAME_DESCRIPTION: Default; ORIENTATION: LANDSCAPE; SIZE: A

### Parts
D1  TS4148 RYG  DIODE0805  [0805_D]
R1  12k  RESISTOR0603  [0603-RES@1]
R2  10k  RESISTOR0603  [0603-RES@1]

### Nets
GND: R2.2
INPUT: D1.A
INPUT_POST_DIODE: D1.C R1.1
OUTPUT: R1.2 R2.1

### Notes on the sheet
- 5V to 3.3V Divider
- Arvind Srinivasan
- 12K to 10K Resistor Divider with Reverse Current Diode

### Library data of the parts
D1 = HyTechDevices:DIODE: DIODE general purpose rectifier
R1 R2 = HyTechDevices:RESISTOR: Resistor Basic schematic elements and footprints for 0603, 1206, and PTH resistors.; TOLERANCE: 1%

## Module 1KHZ-FILTER
Ports: +5V(pwr) GND(pwr) OUTPUT(out) INPUT(in)
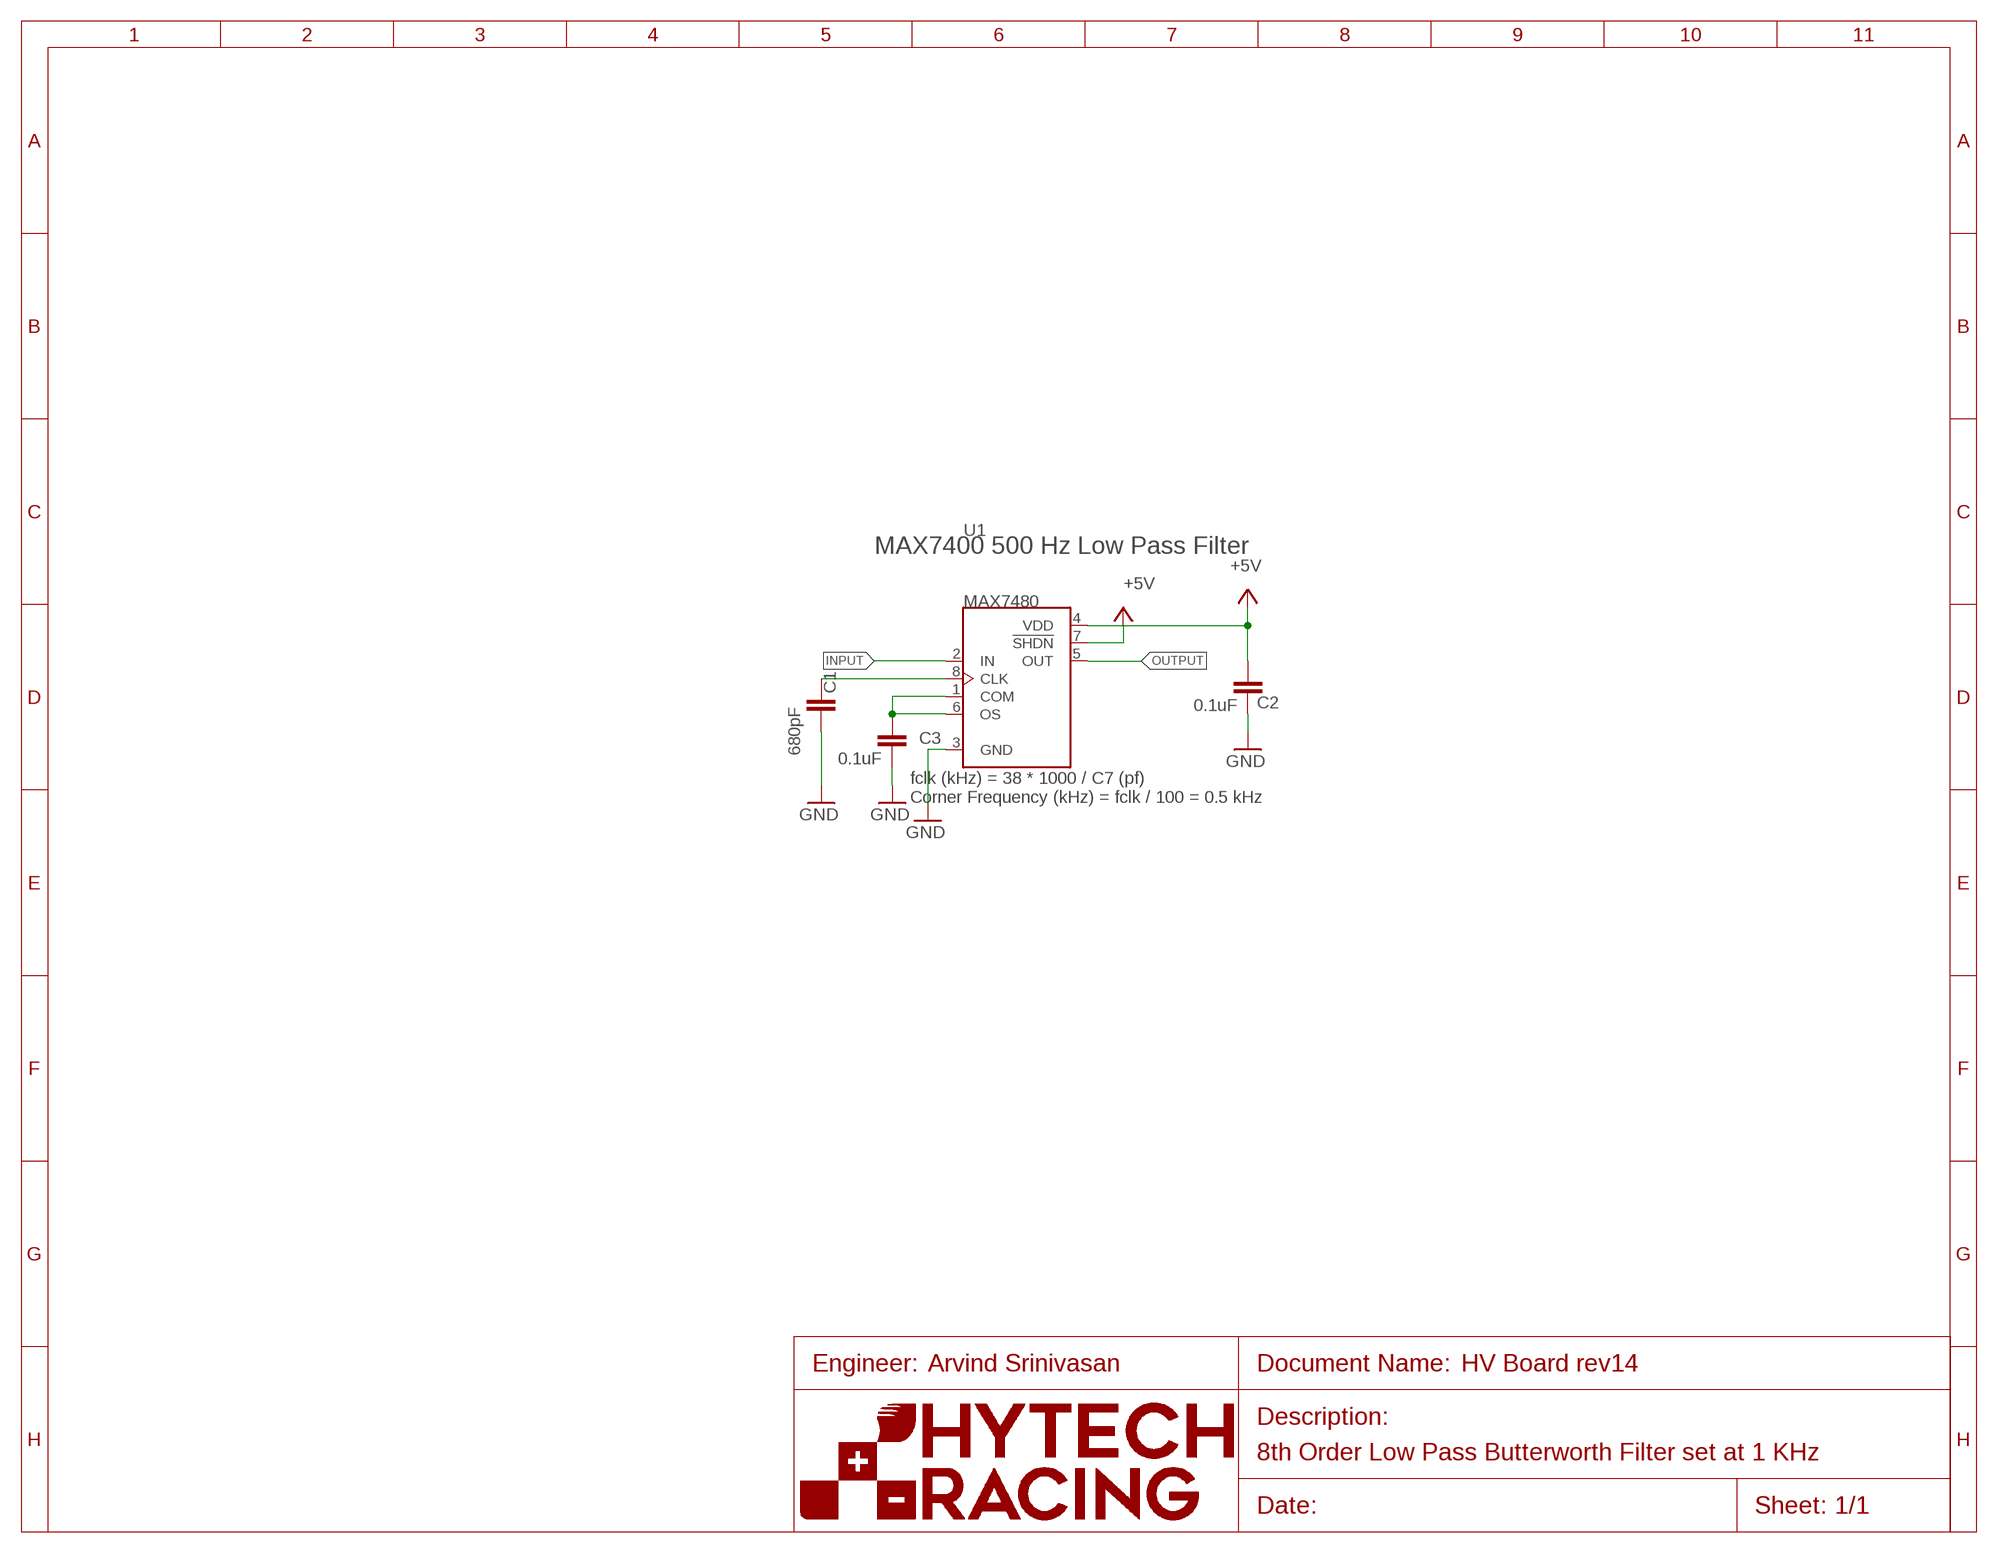
[diagram p5: schematic, module 1KHZ-FILTER, sheet 1]
U$2 (FRAME_A): FRAME_DESCRIPTION: Default; ORIENTATION: LANDSCAPE; SIZE: A

### Parts
C1  680pF  CAP0603-CAP  [0603-CAP@1]
C2  0.1uF  CAP0603-CAP  [0603-CAP@1]
C3  0.1uF  CAP0603-CAP  [0603-CAP@1]
U1  MAX7480  MAX7400  [SOIC-08@2]

### Nets
+5V: C2.1 U1.4(VDD) U1.7(!SHDN)
CLK: C1.1 U1.8(CLK)
COM: C3.1 U1.1(COM) U1.6(OS)
GND: C1.2 C2.2 C3.2 U1.3(GND)
INPUT: U1.2(IN)
OUTPUT: U1.5(OUT)

### Notes on the sheet
- MAX7400 500 Hz Low Pass Filter
- fclk (kHz) = 38 * 1000 / C7 (pf)
  Corner Frequency (kHz) = fclk / 100 = 0.5 kHz
- Arvind Srinivasan
- 8th Order Low Pass Butterworth Filter set at 1 KHz

### Library data of the parts
C1 = HyTechDevices:CAP: Capacitor Standard 0603 ceramic capacitor, and 0.1" leaded capacitor.; TOLERANCE: 1%; VOLTAGE: 10V
C2 C3 = HyTechDevices:CAP: Capacitor Standard 0603 ceramic capacitor, and 0.1" leaded capacitor.; TOLERANCE: 5%; VOLTAGE: 10V
U1 = HyTechDevices:MAX74*: 8th-Order Maxim Filter MAX7480 Datasheet <https://www.mouser.com/datasheet/2/256/MAX7480-1515905.pdf> MAX7400 Datsheet <https://www.mouser.com/datasheet/2/256/MAX7404-1514314.pdf> MAX7404 uses a 680 pF clock capcitor; DKPN: MAX7400CSA+-ND; MANUFACTURER: Maxim Integrated; MOPN: 700-MAX7400CSA; MPN: MAX7400CSA+

## Net classes
1 TS: clearance 2.25 mm to class 0
2 ISO_SPI: clearance 2.25 mm to class 0, clearance 2.25 mm to class 1